# EAGLE design OLED-Clock-6-nl (EAGLE 7.4.0)
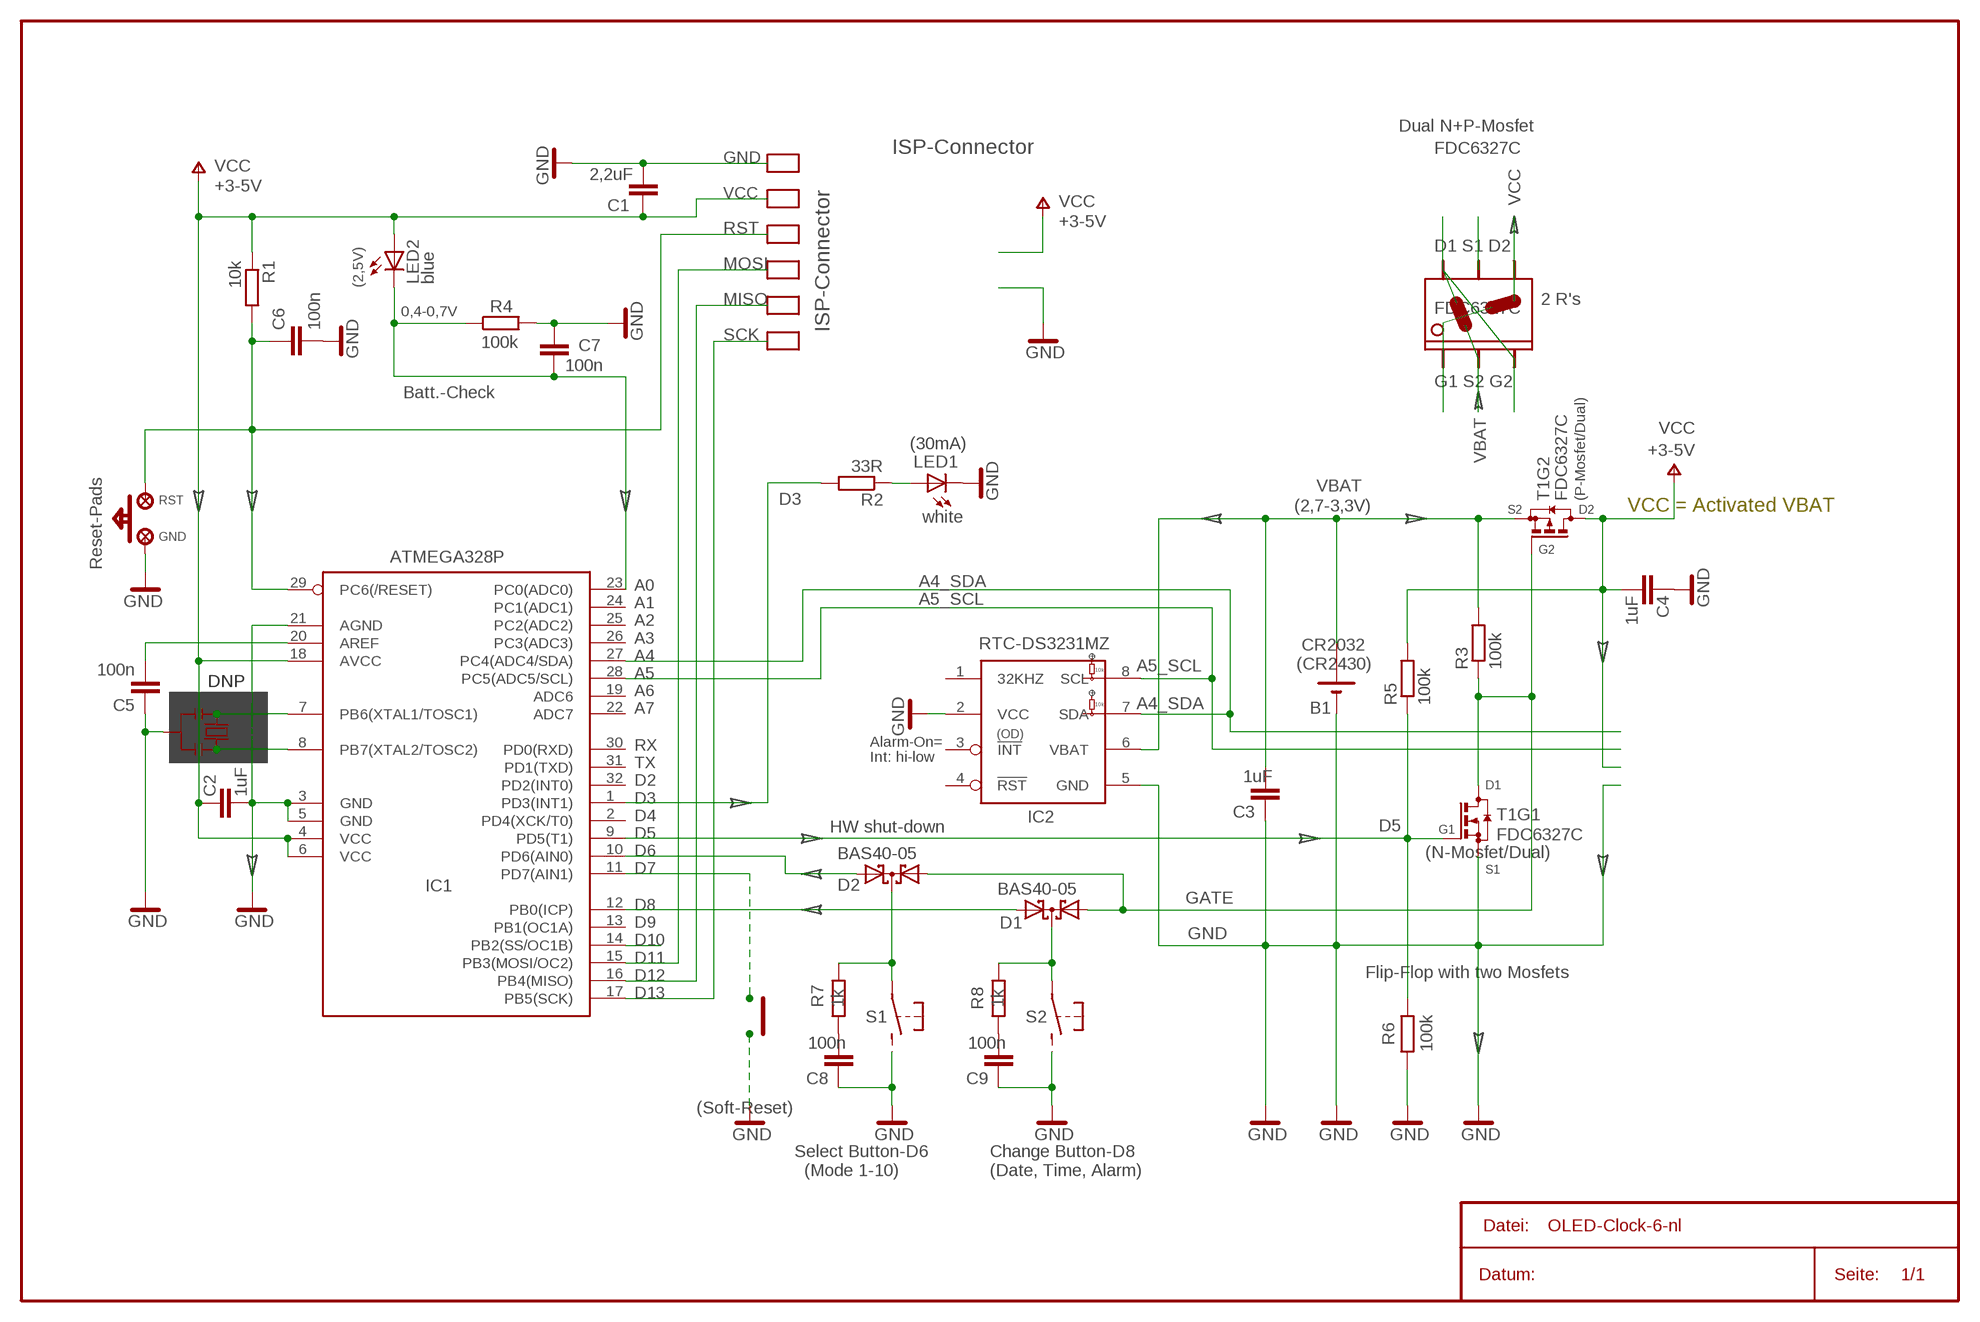
[diagram p0: schematic, sheet 1]

## Parts
C1  2,2uF  C-EUC0603  [C0603]
C2  1uF  C-EUC0603  [C0603]
C3  1uF  C-EUC0603  [C0603]
C4  1uF  C-EUC0603  [C0603]
C5  100n  C-EUC0603  [C0603]
C6  100n  C-EUC0603  [C0603]
C7  100n  C-EUC0603  [C0603]
C8  100n  C-EUC0603  [C0603]
C9  100n  C-EUC0603  [C0603]
D1  BAS40-05  BAS40-051  [SOT23]
D2  BAS40-05  BAS40-051  [SOT23]
GND  LSP20  [LSP20]
IC1  ATMEGA328P  MEGA8-AI  [TQFP32-08]
IC2  DS3231MZ  DS3231  [SO08]
LED1  white  LEDCHIPLED_1206  [CHIPLED_1206]
LED2  blue  LEDCHIPLED_0805  [CHIPLED_0805]
R1  10k  R-EU_R0603  [R0603]
R2  33R  R-EU_R0603  [R0603]
R3  100k  R-EU_R0603  [R0603]
R4  100k  R-EU_R0603  [R0603]
R5  100k  R-EU_R0603  [R0603]
R6  100k  R-EU_R0603  [R0603]
R7  1k  R-EU_R0603  [R0603]
R8  1k  R-EU_R0603  [R0603]
RST  LSP20  [LSP20]
T1  FDC6327C  NP_MOSFET_SOT23-6  [SOT23-6]

## Nets
A0: C7.1 IC1.23(PC0(ADC0)) LED2.C R4.1
A4_SDA: IC1.27(PC4(ADC4/SDA)) IC2.7(SDA)
A5_SCL: IC1.28(PC5(ADC5/SCL)) IC2.8(SCL)
D3: IC1.1(PD3(INT1)) R2.2
D5: IC1.9(PD5(T1)) R5.1 R6.2 T1.1(G)
D6: D2.2(A2) IC1.10(PD6(AIN0))
D7: IC1.11(PD7(AIN1))
GATE: D1.1(A1) D2.1(A1) R3.1 T1.3(G) T1.6(D)
GND: C1.2 C2.2 C3.1 C4.1 C5.1 C6.2 C7.2 C8.1 C9.1 GND.P$1(MP) IC1.3(GND) IC1.5(GND) IC1.21(AGND) IC2.2(VCC) IC2.5(GND) LED1.C R4.2 R6.1 T1.5(S)
MISO: IC1.16(PB4(MISO))
MOSI: IC1.15(PB3(MOSI/OC2))
N$1: D2.3(C) R7.2
N$2: IC1.14(PB2(SS/OC1B))
N$3: C5.2 IC1.20(AREF)
N$6: D1.3(C) R8.2
N$10: D1.2(A2) IC1.12(PB0(ICP))
N$22: LED1.A R2.1
N$30: C8.2 R7.1
N$31: C9.2 R8.1
RST: C6.1 IC1.29(PC6(/RESET)) R1.2 RST.P$1(MP)
SCK: IC1.17(PB5(SCK))
VBAT: C3.2 IC2.6(VBAT) R3.2 T1.2(S)
VCC: C1.1 C2.1 C4.2 IC1.4(VCC) IC1.6(VCC) IC1.18(AVCC) LED2.A R1.1 R5.2 T1.4(D)
X1: IC1.7(PB6(XTAL1/TOSC1))
X2: IC1.8(PB7(XTAL2/TOSC2))
Unconnected: IC1.2(PD4(XCK/T0)) IC1.13(PB1(OC1A)) IC1.19(ADC6) IC1.22(ADC7) IC1.24(PC1(ADC1)) IC1.25(PC2(ADC2)) IC1.26(PC3(ADC3)) IC1.30(PD0(RXD)) IC1.31(PD1(TXD)) IC1.32(PD2(INT0)) IC2.1(32KHZ) IC2.3(!INT) IC2.4(!RST)

## Notes on the sheet
- Dual N+P-Mosfet
- ISP-Connector | FDC6327C
- +3-5V
- VCC
- +3-5V
- D1 S1 D2
- (2,5V)
- 2 R's
- 0,4-0,7V | FDC6327C
- ISP-Connector
- G1 S2 G2
- Batt.-Check
- (30mA)
- +3-5V
- VBAT
- (P-Mosfet/Dual)
- (2,7-3,3V) | S2 | D2 | VCC = Activated VBAT
- G2
- Reset-Pads
- RTC-DS3231MZ
- +
- CR2032
  (CR2430)
- 10k
- DNP
- +
- 16MHz
- 10k
- A0
  A1
  A2
  A3
  A4
  A5
  A6
  A7
- B1
- Q1 | (OD)
- Alarm-On=
  Int: hi-low
- D1
- IC2
- HW shut-down | G1
- (N-Mosfet/Dual)
- RX
  TX
  D2
  D3
  D4
  D5
  D6
  D7
- S1
- Flip-Flop with two Mosfets
- D8
  D9
  D10
  D11
  D12
  D13
- S1 | S2
- (Soft-Reset)
- Select Button-D6
    (Mode 1-10)
- Change Button-D8
  (Date, Time, Alarm)

## Library data of the parts
C1-C9 = rcl1:C-EU: CAPACITOR, European symbol
D1 D2 = diode1:BAS40-05: Silicon Schottky Diodes General-purpose diode for high-speed switching
GND RST = solpad-smd:LSP20: SMD Solder-Pad (2.0mm Outer-Ø)
IC1 = avr-7:MEGA8: MICROCONTROLLER 8 Kbytes FLASH 1 kbytes SRAM 512 bytes EEPROM USART 6-channel 10 bit ADC 2-channel 8 bit ADC
IC2 = DS3231:DS3231: RTC Real-Time Clock with I2C Extremely Accurate I2C-Integrated RTC/TCXO/Crystal - Supply Voltage: 2.3 - 5.5V - Standby Supply Current @ Vcc 3.63V: 110µA ● Highly Accurate RTC Completely Manages All Timekeeping Functions • Real-Time Clock Counts Seconds, Minutes, Hours, Date of the Month, Month, Day of the Week, and Year, with Leap-Year Compensation Valid Up to 2100 • Accuracy ±2ppm from 0°C to +40°C • Accuracy ±3.5ppm from -40°C to +85°C • Digital Temp Sensor Output: ±3°C Accuracy • Register for Aging Trim • RST Output/Pushbutton Reset Debounce Input • Two Time-of-Day Alarms • Programmable Square-Wave Output Signal ● Simple Serial Interface Connects to Most Microcontrollers • Fast (400kHz) I2C Interface ● Battery-Backup Input for Continuous Timekeeping • Low Power Operation Extends Battery-Backup Run Time • 3.3V Operation ● Operating Temperature Ranges: Commercial (0°C to +70°C) and Industrial (-40°C to +85°C)
LED1 LED2 = led:LED: LED OSRAM: - CHIPLED LG R971, LG N971, LY N971, LG Q971, LY Q971, LO R971, LY R971 LH N974, LH R974 LS Q976, LO Q976, LY Q976 LO Q996 - Hyper CHIPLED LW Q18S LB Q993, LB Q99A, LB R99A - SideLED LS A670, LO A670, LY A670, LG A670, LP A670 LB A673, LV A673, LT A673, LW A673 LH A674 LY A675 LS A676, LA A676, LO A676, LY A676, LW A676 LS A679, LY A679, LG A679 - Hyper Micro SIDELED® LS Y876, LA Y876, LO Y876, LY Y876 LT Y87S - SmartLED LW L88C, LW L88S LB L89C, LB L89S, LG L890 LS L89K, LO L89K, LY L89K LS L896, LA L896, LO L896, LY L896 - TOPLED LS T670, LO T670, LY T670, LG T670, LP T670 LSG T670, LSP T670, LSY T670, LOP T670, LYG T670 LG T671, LOG T671, LSG T671 LB T673, LV T673, LT T673, LW T673 LH T674 LS T676, LA T676, LO T676, LY T676, LB T676, LH T676, LSB T676, LW T676 LB T67C, LV T67C, LT T67C, LS T67K, LO T67K, LY T67K, LW E67C LS E67B, LA E67B, LO E67B, LY E67B, LB E67C, LV E67C, LT E67C LW T67C LS T679, LY T679, LG T679 LS T770, LO T770, LY T770, LG T770, LP T770 LB T773, LV T773, LT T773, LW T773 LH T774 LS E675, LA E675, LY E675, LS T675 LS T776, LA T776, LO T776, LY T776, LB T776 LHGB T686 LT T68C, LB T68C - Hyper Mini TOPLED® LB M676 - Mini TOPLED Santana® LG M470 LS M47K, LO M47K, LY M47K Source: http://www.osram.convergy.de LUXEON: - LUMILED® LXK2-PW12-R00, LXK2-PW12-S00, LXK2-PW14-U00, LXK2-PW14-V00 LXK2-PM12-R00, LXK2-PM12-S00, LXK2-PM14-U00 LXK2-PE12-Q00, LXK2-PE12-R00, LXK2-PE12-S00, LXK2-PE14-T00, LXK2-PE14-U00 LXK2-PB12-K00, LXK2-PB12-L00, LXK2-PB12-M00, LXK2-PB14-N00, LXK2-PB14-P00, LXK2-PB14-Q00 LXK2-PR12-L00, LXK2-PR12-M00, LXK2-PR14-Q00, LXK2-PR14-R00 LXK2-PD12-Q00, LXK2-PD12-R00, LXK2-PD12-S00 LXK2-PH12-R00, LXK2-PH12-S00 LXK2-PL12-P00, LXK2-PL12-Q00, LXK2-PL12-R00 Source: www.luxeon.com KINGBRIGHT: KA-3528ASYC Source: www.kingbright.com
R1-R8 = rcl:R-EU_: RESISTOR, European symbol
T1 = transistor-small-signal:NP_MOSFET_SOT23-6: Dual N- & P-Channel Mosfet 20V / ~2A / ~1W / ~100mO / SOT23-6

## Board
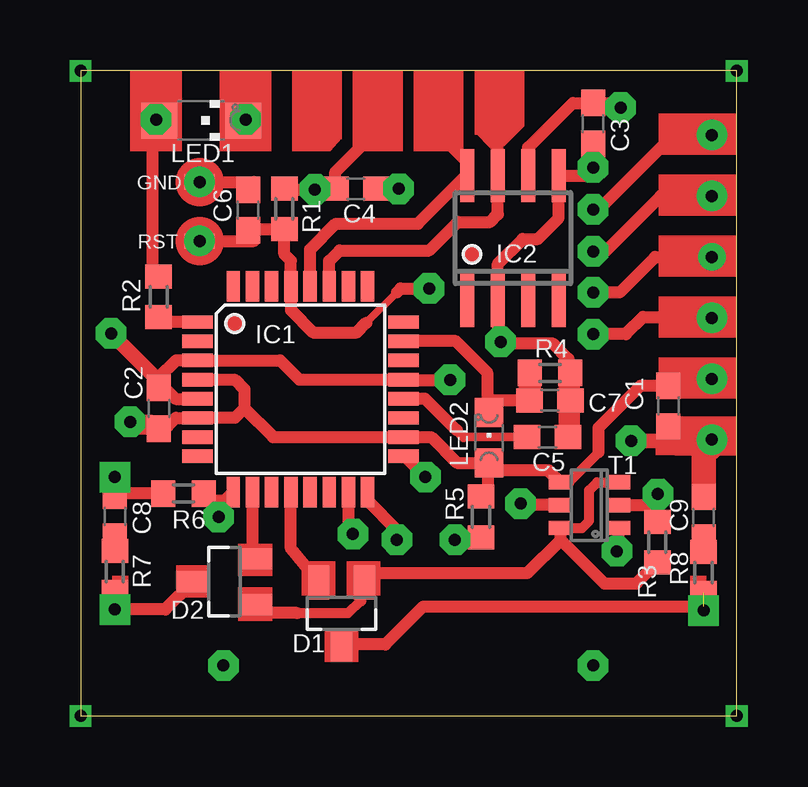
[diagram p1: board, top side]
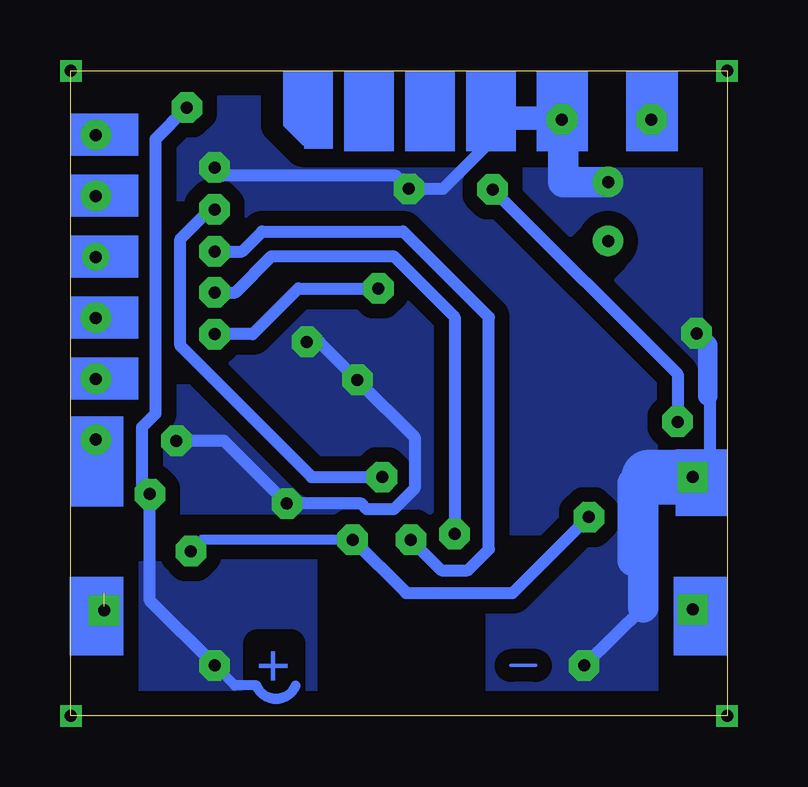
[diagram p2: board, bottom side, seen from below]

Size 27.34 x 26.91 mm. Coordinates in mm from the lower left corner, seen from the top.
Outline: 0,0 27.34,0 27.34,26.91 0,26.91 0,0
Copper layers (1*16): Top 0.035mm / dielectric 1.5mm / Bottom 0.035mm
Design rules "default": minimum track width 10mil, minimum drill 24mil, track to track 8mil, track to pad 8mil, pad to pad 8mil, via to via 8mil, smd to smd 8mil, copper to edge 40mil, drill to drill 8mil, minimum pad ring 10mil, minimum via ring 8mil, stop-mask expansion 4mil, vias tented up to drill 0mil, thermal gap 10mil
bRestrict: area 0.8,6.9 to 2.3,11.6; area 12.1,7.3 to 23.7,7.8; area 23.4,7.1 to 24.8,8.9; area 1,23.6 to 18.7,26; area 22.3,14.4 to 23.4,20.8; area 25.4,10.4 to 26.5,12.5; area 21.9,25.4 to 22.8,26; area 9.1,22.3 to 9.8,23.1; area 4.7,18.6 to 6.1,20

### Footprints (pad centres in the part's own frame; a part is rotated, then mirrored left to right if it is on the bottom)
C0603 = smd 1.1 x 1: 1 -0.85,0; 2 0.85,0
SOT23 = smd 0.889 x 1.397: 1 -0.95,-1.295; 2 0.95,-1.295; 3 0,1.295
LSP20 = smd 1.27 x 0.635: P$1 0,0
TQFP32-08 = smd 1.27 x 0.559: 1 -4.293,2.8; 2 -4.293,2; 3 -4.293,1.2; 4 -4.293,0.4; 5 -4.293,-0.4; 6 -4.293,-1.2; 7 -4.293,-2; 8 -4.293,-2.8; 17 4.293,-2.8; 18 4.293,-2; 19 4.293,-1.2; 20 4.293,-0.4; 21 4.293,0.4; 22 4.293,1.2; 23 4.293,2; 24 4.293,2.8 | smd 0.559 x 1.27: 9 -2.8,-4.293; 10 -2,-4.293; 11 -1.2,-4.293; 12 -0.4,-4.293; 13 0.4,-4.293; 14 1.2,-4.293; 15 2,-4.293; 16 2.8,-4.293; 25 2.8,4.293; 26 2,4.293; 27 1.2,4.293; 28 0.4,4.293; 29 -0.4,4.293; 30 -1.2,4.293; 31 -2,4.293; 32 -2.8,4.293
SO08 = smd 0.6 x 2.2: 1 -1.905,-2.6; 2 -0.635,-2.6; 3 0.635,-2.6; 4 1.905,-2.6; 5 1.905,2.6; 6 0.635,2.6; 7 -0.635,2.6; 8 -1.905,2.6
CHIPLED_1206 = smd 1.5 x 1.5: A 0,-1.75; C 0,1.75
CHIPLED_0805 = smd 1.2 x 1.2: A 0,-1.05; C 0,1.05
R0603 = smd 1 x 1.1: 1 -0.85,0; 2 0.85,0
SOT23-6 = smd 0.6 x 1: 1 -0.95,-1.2; 2 0,-1.2; 3 0.95,-1.2; 4 0.95,1.2; 5 0,1.2; 6 -0.95,1.2

### Placement (x,y rotation side)
C1  24.49,12.92 270 top
C2  3.27,12.83 90 top
C3  21.35,24.7 90 top
C4  11.47,21.99 180 top
C5  19.46,11.63 180 top
C6  6.98,21.09 90 top
C7  19.56,13.15 0 top
C8  1.43,8.33 270 top
C9  25.96,8.29 270 top
D1  10.87,4.28 180 top
D2  5.99,5.6 90 top
GND  4.96,22.27 0 top
IC1  9.16,13.63 0 top
IC2  18.02,19.93 0 top
LED1  5.02,24.83 270 top
LED2  17.02,11.61 0 top
R1  8.49,21.14 270 top
R2  3.25,17.48 270 top
R3  24.03,7.25 90 top
R4  19.56,14.31 0 top
R5  16.68,8.3 90 top
R6  4.29,9.28 0 top
R7  1.43,6.02 270 top
R8  25.96,5.98 270 top
RST  4.96,19.81 0 top
T1  21.2,8.79 90 top

### Tracks (layer width: path | path; a pad name or v marks a point on that pad's centre or on a via)
A0
  Top 0.508: R4.1 C7.1 16.94,13.15 | IC1.23 15.64,15.63 16.94,14.33 16.94,13.15 | 16.94,13.15 LED2.C
A4_SDA
  Top 0.508: 17.38,25.08 IC2.7 17.38,20.92 17.07,20.6 15.72,20.6 14.53,19.41 10.79,19.41 10.36,18.98 IC1.27
A5_SCL
  Top 0.508: IC1.28 9.56,19.45 10.64,20.52 14.05,20.52 16.05,22.53 IC2.8 | 16.11,23.1 14.92,24.29
  Top 0.61: IC2.8 16.11,23.1
D3
  Top 0.508: IC1.1 3.45,16.43 R2.2
D5  (via drill 0.5 pad 1.27)
  Top 0.508: IC1.9 6.02,8.99 | 6.02,8.99 5.75,8.73 v5.75,8.3 | T1.1 22.4,6.92 v22.34,6.87 | R6.2 5.42,8.99 6.02,8.99 | v15.6,7.35 16.58,7.35 R5.1
  Bottom 0.406: v15.6,7.35 21.87,7.35 21.95,7.27
  Bottom 0.508: v5.75,8.3 8.93,5.12 13.38,5.12 v15.6,7.35 | 21.95,7.27 v22.34,6.87
D6
  Top 0.508: IC1.10 7.16,6.68 D2.2
GATE
  Top 0.406: T1.6 20.89,7.84 21.19,8.14 21.19,9.41 21.52,9.74 T1.3 | 9.01,4.29 11.15,4.29 11.67,4.81
  Top 0.508: R3.1 23.15,5.52 21.83,5.52 20,7.35 | 20,7.35 T1.6 | 20,7.35 18.61,5.96 12.2,5.96 11.84,5.6 D1.1 11.67,5.42 11.67,4.81 | 9.01,4.29 7.69,4.29 D2.1
GND  (via drill 0.5 pad 1.27)
  Top 0.508: IC1.5 3.96,13.23 3.51,13.68 C2.2 3.27,14.11 3.99,14.83 IC1.3 8.31,14.83 9.12,14.03 IC1.21 13.47,14.01 v15.4,14.01 | C4.1 12.38,22.05 12.45,21.99 v13.26,21.99 | GND.P$1 7.23,22.27 6.84,22.1 | C3.1 v21.35,22.86 21.02,22.53 IC2.5 19.92,20.76 19.05,19.89 18.41,19.89 17.38,18.86 IC2.2 17.38,15.72 v17.5,15.6 17.58,15.52 19.68,15.52 20.32,14.89 20.32,14.31 R4.2 | C7.2 20.41,11.89 C5.1 | 20.33,14.72 R4.2 | 26.39,10.96 26.43,11 26.43,11.39 v26.3,11.52 | C7.2 20.5,12.98 | C7.2 R4.2 | C1.2 24.45,12.19 24.45,12.04 24.29,11.87 | C6.2 6.98,22.1 | T1.5 18.4,8.79 v18.34,8.86 | 3.33,13.76 3.41,13.68 | 1.43,9.12 C8.1 v1.43,9.97 | v26.3,11.52 26.6,11.22 | v26.3,11.52 25.96,11.52 | R6.1 1.43,9.28
  Top 0.61: 3.33,13.76 C2.2 | 6.83,21.94 C6.2 | v22.94,11.47 24.49,11.47 | 24.49,11.47 C1.2 | 24.49,11.47 26.3,11.47 v26.3,11.52 | 6.98,22.1 6.84,22.1 | LED1.C 6.88,24.83 v6.88,24.87 | 1.43,9.28 C8.1 | 3.27,14.11 3.12,14.11 v1.27,15.95
  Top 1.016: C9.1 25.96,11.52
  Bottom 0.508: v17.5,15.6 16.99,15.6 v15.4,14.01 13.02,11.63 13.02,9.49 13.89,8.62 15,8.62 15.24,8.86 v18.34,8.86 20.95,11.47 v22.94,11.47 | v5.95,2.11 3.49,4.53 | 0.71,13.22 0.71,10.84 v1.43,9.97 1.49,9.97 1.75,9.71 | 9.84,23.97 11.83,21.99 v13.26,21.99 13.8,22.53 21.02,22.53 v21.35,22.86 | 3.49,9.73 3.25,9.97 | 3.94,6.47 3.94,6.74 3.49,7.18
  Bottom 0.61: 6.82,24.79 6.88,24.79 v6.88,24.87
  Bottom 0.813: v1.27,15.95 0.79,15.48 0.79,13.34
  Bottom 1.27: 3.49,4.53 3.49,7.18 3.49,9.73 | 6.82,24.79 6.82,22.25 5.72,22.27 GND.P$1 | 3.93,9.72 3.94,6.47
  Bottom 2.286: 3.25,9.97 v1.43,9.97
  other vias: 4.96,22.27
  pour Bottom (isolate 0.61): 2.94,0 2.94,7.62 10,7.62 10,0
  pour Bottom (isolate 0.61): -0.32,27.11 27.62,27.11 27.62,7.62 -0.32,7.62
  pour Bottom (isolate 0.61): 0.24,24.09 9.05,24.09 9.05,22.59 0.24,13.7
MISO  (via drill 0.5 pad 1.27)
  Top 0.508: IC1.16 11.96,8.96 13.18,7.74 v13.18,7.35 | v26.3,21.68 24.17,21.68 21.86,19.37 v21.35,19.37
  Bottom 0.508: v21.35,19.37 20.2,19.37 19.37,20.21 13.49,20.21 9.92,16.63 9.92,6.95 10.79,6.08 11.91,6.08 v13.18,7.35
MOSI  (via drill 0.5 pad 1.14, 0.5 pad 1.27)
  Top 0.508: IC1.15 11.16,7.78 v11.35,7.58 | v21.35,17.67 22.46,17.67 23.94,19.14 v26.3,19.14
  Bottom 0.508: v21.35,17.67 20.48,17.67 18.97,19.17 13.89,19.17 11.35,16.63 v11.35,7.58
N$1  (via drill 0.5 pad 1.27)
  Top 0.508: R7.2 v1.43,4.44 3.53,4.44 D2.3
N$3
  Top 0.356: C5.2 18.57,11.63 15.95,11.63
  Top 0.406: 15.95,11.63 15.68,11.91
  Top 0.508: IC1.20 14.36,13.23 15.68,11.91
N$4  (via drill 0.5)
  other vias: 0,26.9
N$6  (via drill 0.5 pad 1.27)  (1 unrouted)
  Top 0.508: D1.3 12.7,2.98 14.29,4.57 25.96,4.57 v25.96,4.4
N$8
  Top 0.508: 3.16,24.57 3.27,24.57
N$9  (via drill 0.5)
  other vias: 27.34,26.9
N$10
  Top 0.508: IC1.12 8.76,6.98 D1.2
N$11  (via drill 0.5)
  other vias: 27.34,0
N$12  (via drill 0.5)
  other vias: 0,0
N$14
  Bottom 0.152: 7.98,2.11 9.01,2.11
N$15  (via drill 0.5 pad 1.27)
  other vias: 3.15,24.87
N$16  (via drill 0.5 pad 1.27)
  other vias: 4.96,19.81
N$22
  Top 0.508: R2.1 3.02,18.56 3.02,24.57 LED1.A
N$30
  Top 0.508: C8.2 R7.1
N$31
  Top 0.508: R8.1 C9.2
RST  (via drill 0.5 pad 1.27)
  Top 0.305: 11.91,16.4 13.18,17.67
  Top 0.508: 11.91,16.4 11.51,16 9.68,16 8.76,16.92 IC1.29 8.76,18.98 8.49,19.25 R1.2 7.03,20.29 C6.1 7.22,19.81 RST.P$1 | 13.18,17.67 13.34,17.82 v14.53,17.82 | v26.3,16.6 26.27,16.64 23.44,16.64 22.72,15.92 v21.35,15.92
  Bottom 0.508: v14.53,17.82 17.86,17.82 19.76,15.92 v21.35,15.92
SCK  (via drill 0.5 pad 1.27)
  Top 0.508: v14.37,9.97 13.51,10.83 IC1.17 | v21.35,21.12 21.59,21.12 24.7,24.22 v26.3,24.22
  Bottom 0.508: v14.37,9.97 17.3,9.97 22.78,15.44 22.78,19.89 21.55,21.12 v21.35,21.12
VBAT  (via drill 0.5 pad 1.27)
  Top 0.508: v22.5,25.36 22.31,25.55 C3.2 20.51,25.55 18.65,23.7 IC2.6 | T1.2 24.05,8.79 v24.05,9.25 24.05,8.18 R3.2
  Bottom 0.406: 17.98,1.27 arc138 19.61,1.27 20.51,1.27 v21.35,2.11
  Bottom 0.508: 22.78,25.09 v22.5,25.36 23.81,24.05 23.81,12.61 24.37,12.05 24.37,9.57 v24.05,9.25 24.05,4.81 v21.35,2.11
  pour Bottom (isolate 0.61): 17.14,0 17.14,7.62 24.45,7.62 24.45,0
VCC  (via drill 0.5 pad 1.27)
  Top 0.406: 20.33,9.74 21.59,11
  Top 0.508: 3.56,12.02 3.77,12.23 | 3.77,12.23 3.97,12.43 IC1.6 6.43,12.43 6.83,12.82 | IC1.4 6.42,14.03 6.83,13.62 6.83,12.82 | 6.83,12.82 8.02,11.63 IC1.18 14.61,11.63 15.68,10.55 LED2.A | v26.3,14.06 24.73,14.06 24.65,13.98 C1.1 | 16.69,9.07 R5.2 | C4.2 10.3,21.99 10.26,21.95 v9.76,21.95 8.54,21.95 R1.1 | 16.53,9.07 R5.2 | 10.58,21.95 C4.2 | 16.68,9.08 R5.2 | 3.77,12.23 3.52,12.23 C2.1 2.35,11.98 v2.06,12.27 | 24.34,13.93 C1.1 | R5.2 16.68,9.09 16.83,9.09 | LED2.A 17.37,10.24 19.5,10.24 T1.4 20.33,9.74 | R5.2 16.99,9.46 16.99,10.48 LED2.A | 24.36,13.93 C1.1 | 21.59,11 21.59,12.03 23.33,13.77 C1.1 | C4.2 10.62,22.68 12.38,24.45
  Bottom 0.508: 2.06,12.43 v2.06,12.27 2.06,14.25 v9.76,21.95
(copper drawn outside any net)
  shapes: Bottom area x18, Top area x29, Top circle x2

### Text on the board
Bottom: +
tValues: Board: 28x27mm | ~ | Layer: | 1. Batt. (CR2430) bottom / 2. ATmega-Board mean / 3. OLED-Display top | D2 | D1 | D0 | RST | A5 | A4 | D3 | A1 | RM2,54mm | GND | D4 | A0 | VCC | GND | GND | AREF | VCC | X1 | X2 | SCK | VCC | SCK / MISO / MOSI / RST / VCC / GND | GND | D5 | D6 | D7 | D8 | D9 | D10 | MISO | Select Button | Change Butt. | GND | VBAT
Document: Bat- | Bat+
tDocu: Cut | Cut
Batt.: CR2032
Arrows: Cut | Cut | Cut | Cut